# Altium schematic sheet AS7265x_Setup.SchDoc
size A4; SheetNumber: 1; SheetTotal: 1
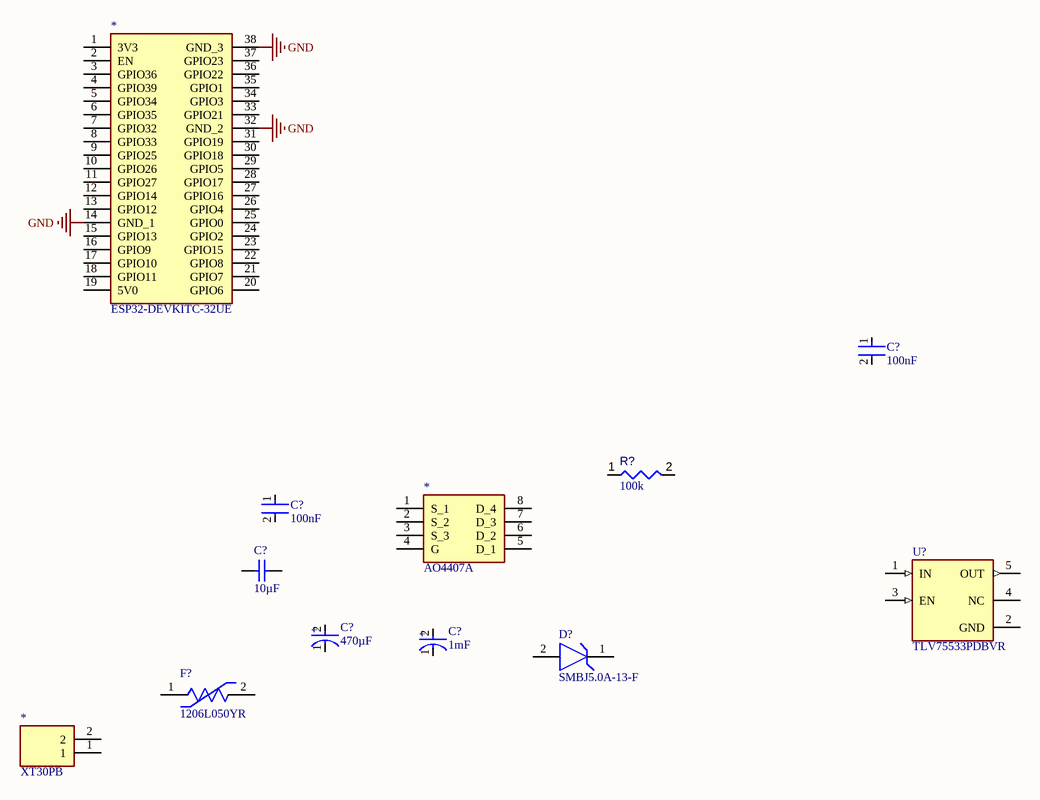
[diagram p0: AS7265x_Setup.SchDoc]

## Parts
(Parts that share a designator on the sheet are numbered #1, #2 ... from top to bottom, then left to right.)
*#1  ESP32-DEVKITC-32UE  [ESP32-DEVKITC-32UE-Footprint-1]
*#2  AO4407A  [AO4407A-Footprint-1]
*#3  XT30PB  [XT30PB-Footprint-1]
C?#1  value 100nF  [FP-CC1206-1_25-MFG]  (hidden comment: CC1206KRX7R9BB104)
C?#2  value 100nF  [FP-CC1206-1_25-MFG]  (hidden comment: CC1206KRX7R9BB104)
C?#3  value 10µF  [CAPC3216X180X55ML20T25]  (hidden comment: GRM31CR71C106KA12L)
C?#4  value 470µF  [FP-RAD-TH-D_8_0_5-L_11_5-MFG]  (hidden comment: EEUFR1A471)
C?#5  value 1mF  [FP-RAD-TH-D_8_0_5-L_15_1-MFG]  (hidden comment: EEUFR1A102L)
D?  SMBJ5.0A-13-F  [FP-SMB-MFG]
F?  1206L050YR  [FP-1206L050YR-MFG]
R?  value 100k  [RESC3216X60X45ML15T20]  (hidden comment: Resistor 100k +/-1% 1206 250 mW)
U?  TLV75533PDBVR  [FP-DBV0005A-MFG]

## Nets
GND: *#1.14(GND_1) *#1.32(GND_2) *#1.38(GND_3)

Not connected (* = marked no-connect by the designer): *#1 1(3V3) 2(EN) 3(GPIO36) 4(GPIO39) 5(GPIO34) 6(GPIO35) 7(GPIO32) 8(GPIO33) 9(GPIO25) 10(GPIO26) 11(GPIO27) 12(GPIO14) 13(GPIO12) 15(GPIO13) 16(GPIO9) 17(GPIO10) 18(GPIO11) 19(5V0) 20(GPIO6) 21(GPIO7) 22(GPIO8) 23(GPIO15) 24(GPIO2) 25(GPIO0) 26(GPIO4) 27(GPIO16) 28(GPIO17) 29(GPIO5) 30(GPIO18) 31(GPIO19) 33(GPIO21) 34(GPIO3) 35(GPIO1) 36(GPIO22) 37(GPIO23); *#2 1(S_1) 2(S_2) 3(S_3) 4(G) 5(D_1) 6(D_2) 7(D_3) 8(D_4); *#3 1 2; C?#1 1 2; C?#2 1 2; C?#3 1 2; C?#4 1(C) 2(A); C?#5 1(C) 2(A); D? 1(C) 2(A); F? 1 2; R? 1 2; U? 1(IN) 2(GND) 3(EN) 4(NC) 5(OUT)

## Notes on the sheet
- (in symbol CMP-001-00098-1) +
- (in symbol CMP-001-00099-1) +

## Library data of the parts
*#1 = CMP-020-00024-1: ESP32-WROOM-32UE Series Evaluation Board 802.11 b/g/n (WiFi, WLAN) Bluetooth Smart Ready 4.x Dual Mode
*#2 = CMP-013-00036-1: Mosfet P-ch 30V 12A 8SOIC / Trans Mosfet P-ch 30V 12A 8-PIN SOIC; Case/Package: SOIC; Pins: 8; Max Operating Temperature: 150°C; Min Operating Temperature: -55°C; Mounting Technology: Surface Mount
*#3 = CMP-002-00071-1: Mini XT60 XT30 Connector for RC Multirotor Racing Drone Quadcopter; Pins: 4
C?#1 C?#2 = CMP-001-00101-1: 50V 100nF X7R ±10% 1206 Multilayer Ceramic Capacitors MLCC - SMD/SMT ROHS; Case/Package: 1206; Tolerance: 10%; Max Operating Temperature: 125°C; Voltage Rating: 50V; Mounting Technology: Surface Mount; Pins: 2; Min Operating Temperature: -55°C
C?#3 = CMP-001-00100-1: 16V 10uF X7R ±10% 1206 Multilayer Ceramic Capacitors MLCC - SMD/SMT ROHS; Pins: 2; Tolerance: 10%; Voltage Rating: 16V; Mounting Technology: Surface Mount; Max Operating Temperature: 125°C; Min Operating Temperature: -55°C; Case/Package: 1206
C?#4 = CMP-001-00098-1: Panasonic EEUFR1A471 - Aluminum Electrolytic Capacitors (Radial Lead Type); Voltage Rating: 10V; Ripple Current (AC): 950mA; Tolerance: 20%; Min Operating Temperature: -40°C; Ripple Current: 950mA; Max Operating Temperature: 105°C; Case/Package: Radial
C?#5 = CMP-001-00099-1: Aluminum Electrolytic Capacitor, 1000 uF, 10 V, ± 20%, 8000 hours @ 105°C, Radial Leaded; Ripple Current (AC): 1.24A; Voltage Rating: 10V; Max Operating Temperature: 105°C; Mounting Technology: PCB, Through Hole; Ripple Current: 1.24A; Case/Package: Radial; Min Operating Temperature: -40°C; Tolerance: 20%; Pins: 2
D? = CMP-004-00035-1: SMBJ5.0A Series 600 W 5.0 V Surface Mount Uni-Directional TVS Diode - DO-214AA; Forward Voltage: 5V; Max Surge Current: 65.2A; Pins: 2; Min Operating Temperature: -55°C; Max Operating Temperature: 150°C; Mounting Technology: Surface Mount; Case/Package: SMB
F? = CMP-005-00013-1: PTC Resettable Fuse 0.5A(hold) 1A(trip) 6VDC 100A 0.6W 0.1s 0.15Ohm SMD Solder Pad 1206 T/R; Min Operating Temperature: -40°C; Mounting Technology: Surface Mount; Max Operating Temperature: 85°C; Current Rating: 100A; Case/Package: 1206
R? = CMP-009-00025-5: Chip Resistor, 100 KOhm, +/- 1%, 0.25 W, -55 to 155 degC, 1206 (3216 Metric); Voltage Rating: 200V; Power: 250mW; RoHS Compliant: True; Max Operating Temperature: 155°C; Pins: 2; Tolerance: 1%; Mounting Technology: SM; Case/Package: 1206; Min Operating Temperature: -55°C
U? = CMP-014-00007-1: 500mA high-PSRR low-IQ low-dropout voltage regulator with enable 5-SOT-23 -40 to 125; Max Supply Voltage: 5.5V; Min Supply Voltage: 1.45V; Max Operating Temperature: 125°C; Pins: 5; Case/Package: SOT-23; Min Operating Temperature: -40°C